# EAGLE schematic sensorHub (EAGLE 9.6.2)
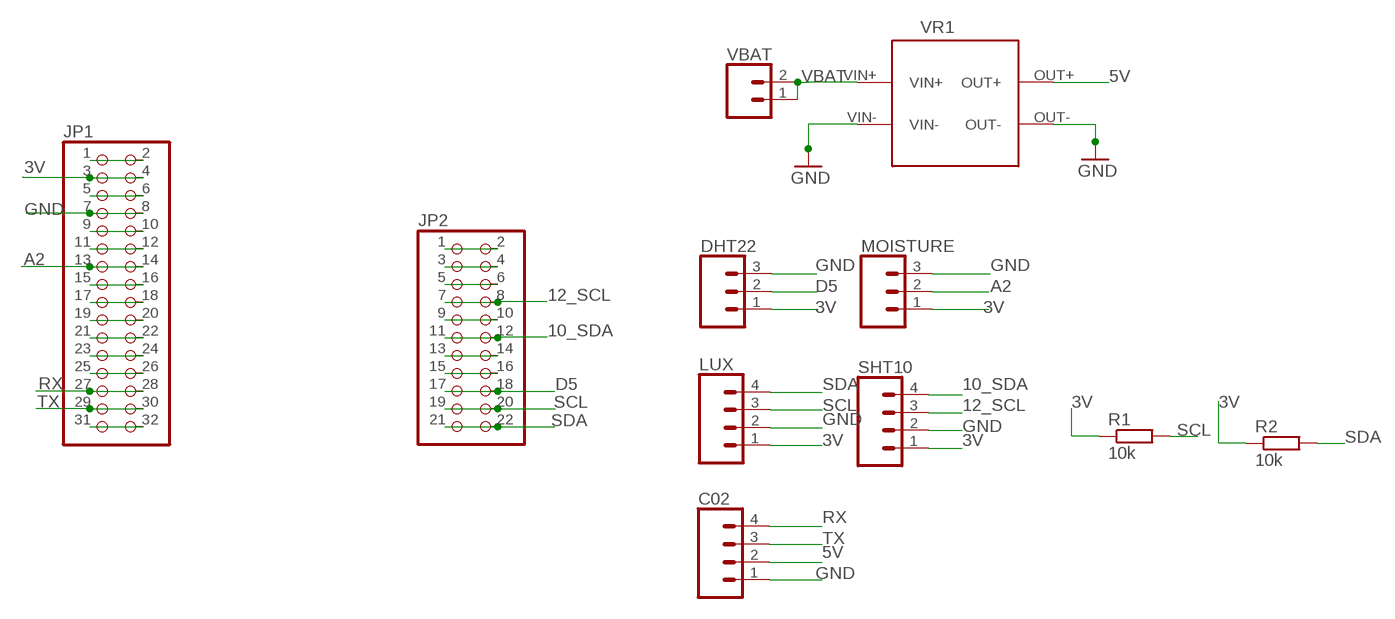
[diagram p0: schematic, sheet 1]

## Parts
C02  CONN_04SCREW  [SCREWTERMINAL-3.5MM-4]
DHT22  CONN_03SCREW  [SCREWTERMINAL-3.5MM-3]
JP1  PINHD-2X16  [2X16]
JP2  PINHD-2X11  [2X11]
LUX  CONN_04SCREW  [SCREWTERMINAL-3.5MM-4]
MOISTURE  CONN_03SCREW  [SCREWTERMINAL-3.5MM-3]
R1  10k  R-EU_0207/10  [0207/10]
R2  10k  R-EU_0207/10  [0207/10]
SHT10  CONN_04SCREW  [SCREWTERMINAL-3.5MM-4]
VBAT  CONN_02  [1X02]
VR1  MT3608THROUGH_HOLE  [MT3608]

## Nets
3V: DHT22.1 JP1.3 JP1.4 LUX.1 MOISTURE.1 R1.1 R2.1 SHT10.1
5V: C02.2 VR1.OUT+
10_SDA: JP2.11 JP2.12 SHT10.4
12_SCL: JP2.7 JP2.8 SHT10.3
A2: JP1.13 JP1.14 MOISTURE.2
D5: DHT22.2 JP2.17 JP2.18
GND: C02.1 DHT22.3 JP1.7 JP1.8 LUX.2 MOISTURE.3 SHT10.2 VR1.OUT- VR1.VIN-
N$1: JP1.1 JP1.2
N$3: JP1.5 JP1.6
N$5: JP1.9 JP1.10
N$6: JP1.11 JP1.12
N$8: JP1.15 JP1.16
N$9: JP1.17 JP1.18
N$10: JP1.19 JP1.20
N$11: JP1.21 JP1.22
N$12: JP1.23 JP1.24
N$13: JP1.25 JP1.26
N$16: JP1.31 JP1.32
N$17: JP2.1 JP2.2
N$18: JP2.3 JP2.4
N$19: JP2.5 JP2.6
N$21: JP2.9 JP2.10
N$23: JP2.13 JP2.14
N$24: JP2.15 JP2.16
RX: C02.4 JP1.27 JP1.28
SCL: JP2.19 JP2.20 LUX.3 R1.2
SDA: JP2.21 JP2.22 LUX.4 R2.2
TX: C02.3 JP1.29 JP1.30
VBAT: VBAT.1 VBAT.2 VR1.VIN+

## Library data of the parts
C02 LUX SHT10 = SparkFun-Connectors:CONN_04: Multi connection point. Often used as Generic Header-pin footprint for 0.1 inch spaced/style header connections On any of the 0.1 inch spaced packages, you can populate with these: Break Away Headers - Straight <https://www.sparkfun.com/products/116> (PRT-00116) Break Away Male Headers - Right Angle <https://www.sparkfun.com/products/553> (PRT-00553) Female Headers <https://www.sparkfun.com/products/115> (PRT-00115) Break Away Headers - Machine Pin <https://www.sparkfun.com/products/117> (PRT-00117) Break Away Female Headers - Swiss Machine Pin <https://www.sparkfun.com/products/743> (PRT-00743) For SCREWTERMINALS and SPRING TERMINALS visit here: Screw Terimnals on SparkFun.com <https://www.sparkfun.com/search/results?term=Screw+Terminals> (5mm/3.5mm/2.54mm spacing) This device is also useful as a general connection point to wire up your design to another part of your project. Our various solder wires solder well into these plated through hole pads. Hook-Up Wire - Assortment (Stranded, 22 AWG) <https://www.sparkfun.com/products/11375> (PRT-11375) Hook-Up Wire - Assortment (Solid Core, 22 AWG) <https://www.sparkfun.com/products/11367> (PRT-11367) View the entire wire category on our website here <https://www.sparkfun.com/categories/141> Special notes: Molex polarized connector foot print use with SKU : PRT-08231 with associated crimp pins and housings. 1MM SMD Version SKU: PRT-10208; PROD_ID: 2xCONN-08399; SF_ID: 2xPRT-08084
DHT22 MOISTURE = SparkFun-Connectors:CONN_03: Multi connection point. Often used as Generic Header-pin footprint for 0.1 inch spaced/style header connections On any of the 0.1 inch spaced packages, you can populate with these: Break Away Headers - Straight <https://www.sparkfun.com/products/116> (PRT-00116) Break Away Male Headers - Right Angle <https://www.sparkfun.com/products/553> (PRT-00553) Female Headers <https://www.sparkfun.com/products/115> (PRT-00115) Break Away Headers - Machine Pin <https://www.sparkfun.com/products/117> (PRT-00117) Break Away Female Headers - Swiss Machine Pin <https://www.sparkfun.com/products/743> (PRT-00743) Stackable Header - 3 Pin (Female, 0.1") <https://www.sparkfun.com/products/13875> (PRT-13875) For SCREWTERMINALS and SPRING TERMINALS visit here: Screw Terimnals on SparkFun.com <https://www.sparkfun.com/search/results?term=Screw+Terminals> (5mm/3.5mm/2.54mm spacing) This device is also useful as a general connection point to wire up your design to another part of your project. Our various solder wires solder well into these plated through hole pads. Hook-Up Wire - Assortment (Stranded, 22 AWG) <https://www.sparkfun.com/products/11375> (PRT-11375) Hook-Up Wire - Assortment (Solid Core, 22 AWG) <https://www.sparkfun.com/products/11367> (PRT-11367) View the entire wire category on our website here <https://www.sparkfun.com/categories/141> Special notes: Molex polarized connector foot print use with SKU : PRT-08232 with associated crimp pins and housings.; PROD_ID: CONN-08288; SF_ID: PRT-08235
JP1 = pinhead:PINHD-2X16: PIN HEADER
JP2 = pinhead:PINHD-2X11: PIN HEADER
R1 R2 = resistor:R-EU_: RESISTOR, European symbol
VBAT = SparkFun-Connectors:CONN_02: Multi connection point. Often used as Generic Header-pin footprint for 0.1 inch spaced/style header connections On any of the 0.1 inch spaced packages, you can populate with these: Break Away Headers - Straight <https://www.sparkfun.com/products/116> (PRT-00116) Break Away Male Headers - Right Angle <https://www.sparkfun.com/products/553> (PRT-00553) Female Headers <https://www.sparkfun.com/products/115> (PRT-00115) Break Away Headers - Machine Pin <https://www.sparkfun.com/products/117> (PRT-00117) Break Away Female Headers - Swiss Machine Pin <https://www.sparkfun.com/products/743> (PRT-00743) For SCREWTERMINALS and SPRING TERMINALS visit here: Screw Terimnals on SparkFun.com <https://www.sparkfun.com/search/results?term=Screw+Terminals> (5mm/3.5mm/2.54mm spacing) This device is also useful as a general connection point to wire up your design to another part of your project. Our various solder wires solder well into these plated through hole pads. Hook-Up Wire - Assortment (Stranded, 22 AWG) <https://www.sparkfun.com/products/11375> (PRT-11375) Hook-Up Wire - Assortment (Solid Core, 22 AWG) <https://www.sparkfun.com/products/11367> (PRT-11367) View the entire wire category on our website here <https://www.sparkfun.com/categories/141> Special notes: Molex polarized connector foot print use with: PRT-08233 with associated crimp pins and housings. 2.54_SCREWTERM for use with PRT-10571. 3.5mm Screw Terminal footprints for PRT-08084 5mm Screw Terminal footprints for use with PRT-08432
VR1 = lm2577_module:MT3608: This is the LM2577 device forMT3608 package with a usb connector